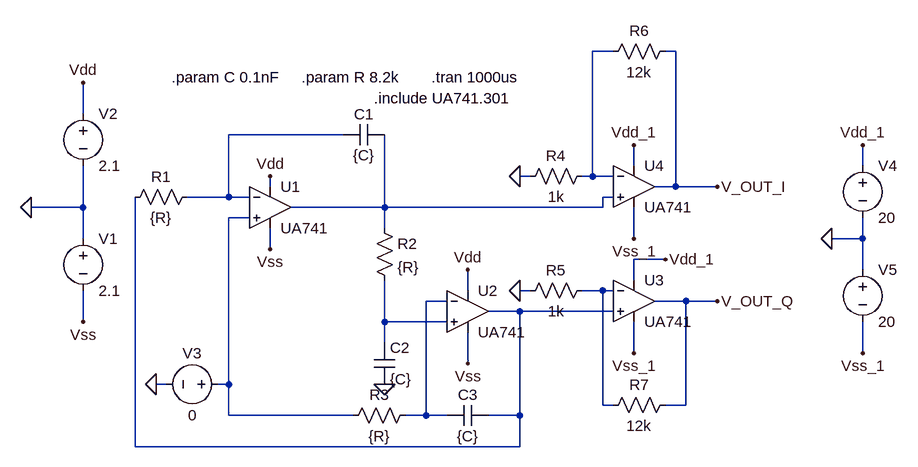
[diagram p0: schematic complete_circuit.asc]
complete_circuit.asc, the LTspice schematic file:
Version 4
SHEET 1 1320 680
WIRE 880 -112 848 -112
WIRE 976 -112 960 -112
WIRE 64 -16 64 -64
WIRE 464 16 288 16
WIRE 912 64 912 32
WIRE 1264 64 1264 32
WIRE 752 80 736 80
WIRE 848 80 848 -112
WIRE 848 80 832 80
WIRE 880 80 848 80
WIRE 352 96 352 80
WIRE 976 96 976 -112
WIRE 976 96 944 96
WIRE 1040 96 976 96
WIRE 288 112 288 16
WIRE 288 112 224 112
WIRE 320 112 288 112
WIRE 880 112 864 112
WIRE 64 128 64 64
WIRE 64 128 -16 128
WIRE 528 128 528 16
WIRE 528 128 384 128
WIRE 864 128 864 112
WIRE 864 128 528 128
WIRE 320 144 288 144
WIRE 528 160 528 128
WIRE 64 176 64 128
WIRE 912 176 912 128
WIRE 1264 176 1264 144
WIRE 1264 176 1216 176
WIRE 352 192 352 160
WIRE 960 208 912 208
WIRE 1264 224 1264 176
WIRE 912 240 912 208
WIRE 656 256 656 224
WIRE 752 256 736 256
WIRE 864 256 832 256
WIRE 880 256 864 256
WIRE 624 272 592 272
WIRE 992 272 944 272
WIRE 1040 272 992 272
WIRE 736 288 688 288
WIRE 880 288 736 288
WIRE 64 304 64 256
WIRE 528 304 528 240
WIRE 624 304 528 304
WIRE 528 336 528 304
WIRE 912 352 912 304
WIRE 1264 352 1264 304
WIRE 656 368 656 320
WIRE 192 400 176 400
WIRE 288 400 288 144
WIRE 288 400 272 400
WIRE 864 432 864 256
WIRE 880 432 864 432
WIRE 992 432 992 272
WIRE 992 432 960 432
WIRE 288 448 288 400
WIRE 480 448 288 448
WIRE 592 448 592 272
WIRE 592 448 560 448
WIRE 624 448 592 448
WIRE 736 448 736 288
WIRE 736 448 688 448
WIRE 144 496 144 112
WIRE 736 496 736 448
WIRE 736 496 144 496
FLAG -16 128 0
FLAG 64 -64 Vdd
FLAG 64 304 Vss
FLAG 176 400 0
FLAG 352 80 Vdd
FLAG 352 192 Vss
FLAG 528 400 0
FLAG 656 368 Vss
FLAG 656 224 Vdd
FLAG 912 352 Vss_1
FLAG 912 32 Vdd_1
FLAG 736 80 0
FLAG 736 256 0
FLAG 1040 96 V_OUT_I
FLAG 1040 272 V_OUT_Q
FLAG 1216 176 0
FLAG 1264 32 Vdd_1
FLAG 1264 352 Vss_1
FLAG 912 176 Vss_1
FLAG 960 208 Vdd_1
SYMBOL res 240 96 R90
WINDOW 0 0 56 VBottom 2
WINDOW 3 32 56 VTop 2
SYMATTR InstName R1
SYMATTR Value {R}
SYMBOL voltage 64 160 R0
SYMATTR InstName V1
SYMATTR Value 2.1
SYMBOL voltage 64 -32 R0
SYMATTR InstName V2
SYMATTR Value 2.1
SYMBOL OpAmps\\opamp2 352 64 R0
SYMATTR InstName U1
SYMATTR Value UA741
SYMBOL cap 528 0 R90
WINDOW 0 0 32 VBottom 2
WINDOW 3 32 32 VTop 2
SYMATTR InstName C1
SYMATTR Value {C}
SYMBOL res 512 144 R0
SYMATTR InstName R2
SYMATTR Value {R}
SYMBOL OpAmps\\opamp2 656 224 R0
SYMATTR InstName U2
SYMATTR Value UA741
SYMBOL voltage 288 400 R90
WINDOW 0 -32 56 VBottom 2
WINDOW 3 32 56 VTop 2
SYMATTR InstName V3
SYMATTR Value 0
SYMBOL cap 512 336 R0
SYMATTR InstName C2
SYMATTR Value {C}
SYMBOL res 576 432 R90
WINDOW 0 0 56 VBottom 2
WINDOW 3 32 56 VTop 2
SYMATTR InstName R3
SYMATTR Value {R}
SYMBOL cap 688 432 R90
WINDOW 0 0 32 VBottom 2
WINDOW 3 32 32 VTop 2
SYMATTR InstName C3
SYMATTR Value {C}
SYMBOL OpAmps\\opamp2 912 208 R0
SYMATTR InstName U3
SYMATTR Value UA741
SYMBOL OpAmps\\opamp2 912 32 R0
SYMATTR InstName U4
SYMATTR Value UA741
SYMBOL res 848 240 R90
WINDOW 0 0 56 VBottom 2
WINDOW 3 32 56 VTop 2
SYMATTR InstName R5
SYMATTR Value 1k
SYMBOL res 848 64 R90
WINDOW 0 0 56 VBottom 2
WINDOW 3 32 56 VTop 2
SYMATTR InstName R4
SYMATTR Value 1k
SYMBOL res 976 -128 R90
WINDOW 0 0 56 VBottom 2
WINDOW 3 32 56 VTop 2
SYMATTR InstName R6
SYMATTR Value 12k
SYMBOL res 976 416 R90
WINDOW 0 0 56 VBottom 2
WINDOW 3 32 56 VTop 2
SYMATTR InstName R7
SYMATTR Value 12k
SYMBOL voltage 1264 48 R0
WINDOW 123 0 0 Left 0
WINDOW 39 0 0 Left 0
SYMATTR InstName V4
SYMATTR Value 20
SYMBOL voltage 1264 208 R0
WINDOW 123 0 0 Left 0
WINDOW 39 0 0 Left 0
SYMATTR InstName V5
SYMATTR Value 20
TEXT 200 -72 Left 2 !.param C 0.1nF
TEXT 400 -72 Left 2 !.param R 8.2k
TEXT 600 -72 Left 2 !.tran 1000us
TEXT 512 -40 Left 2 !.include UA741.301

The netlist it stands for:
* complete_circuit.asc
R1 N002 N007 {R}
V1 0 Vss 2.1
V2 Vdd 0 2.1
XU1 N004 N002 Vdd Vss N003 UA741  ; pins In+ In- V+ V- OUT
C1 N003 N002 {C}
R2 N003 N008 {R}
XU2 N008 N006 Vdd Vss N007 UA741  ; pins In+ In- V+ V- OUT
V3 N004 0 0
C2 N008 0 {C}
R3 N006 N004 {R}
C3 N007 N006 {C}
XU3 N007 N005 Vdd_1 Vss_1 V_OUT_Q UA741  ; pins In+ In- V+ V- OUT
XU4 N003 N001 Vdd_1 Vss_1 V_OUT_I UA741  ; pins In+ In- V+ V- OUT
R5 N005 0 1k
R4 N001 0 1k
R6 V_OUT_I N001 12k
R7 V_OUT_Q N005 12k
V4 Vdd_1 0 20
V5 0 Vss_1 20
.param C 0.1nF
.param R 8.2k
.tran 1000us
.include UA741.301
.backanno
.end